# EasyEDA schematic pickup3.json
TITLE: Sheet_1; REV: 1.0; Date: 2023-07-27; Sheet: 1/1; Company: Your Company
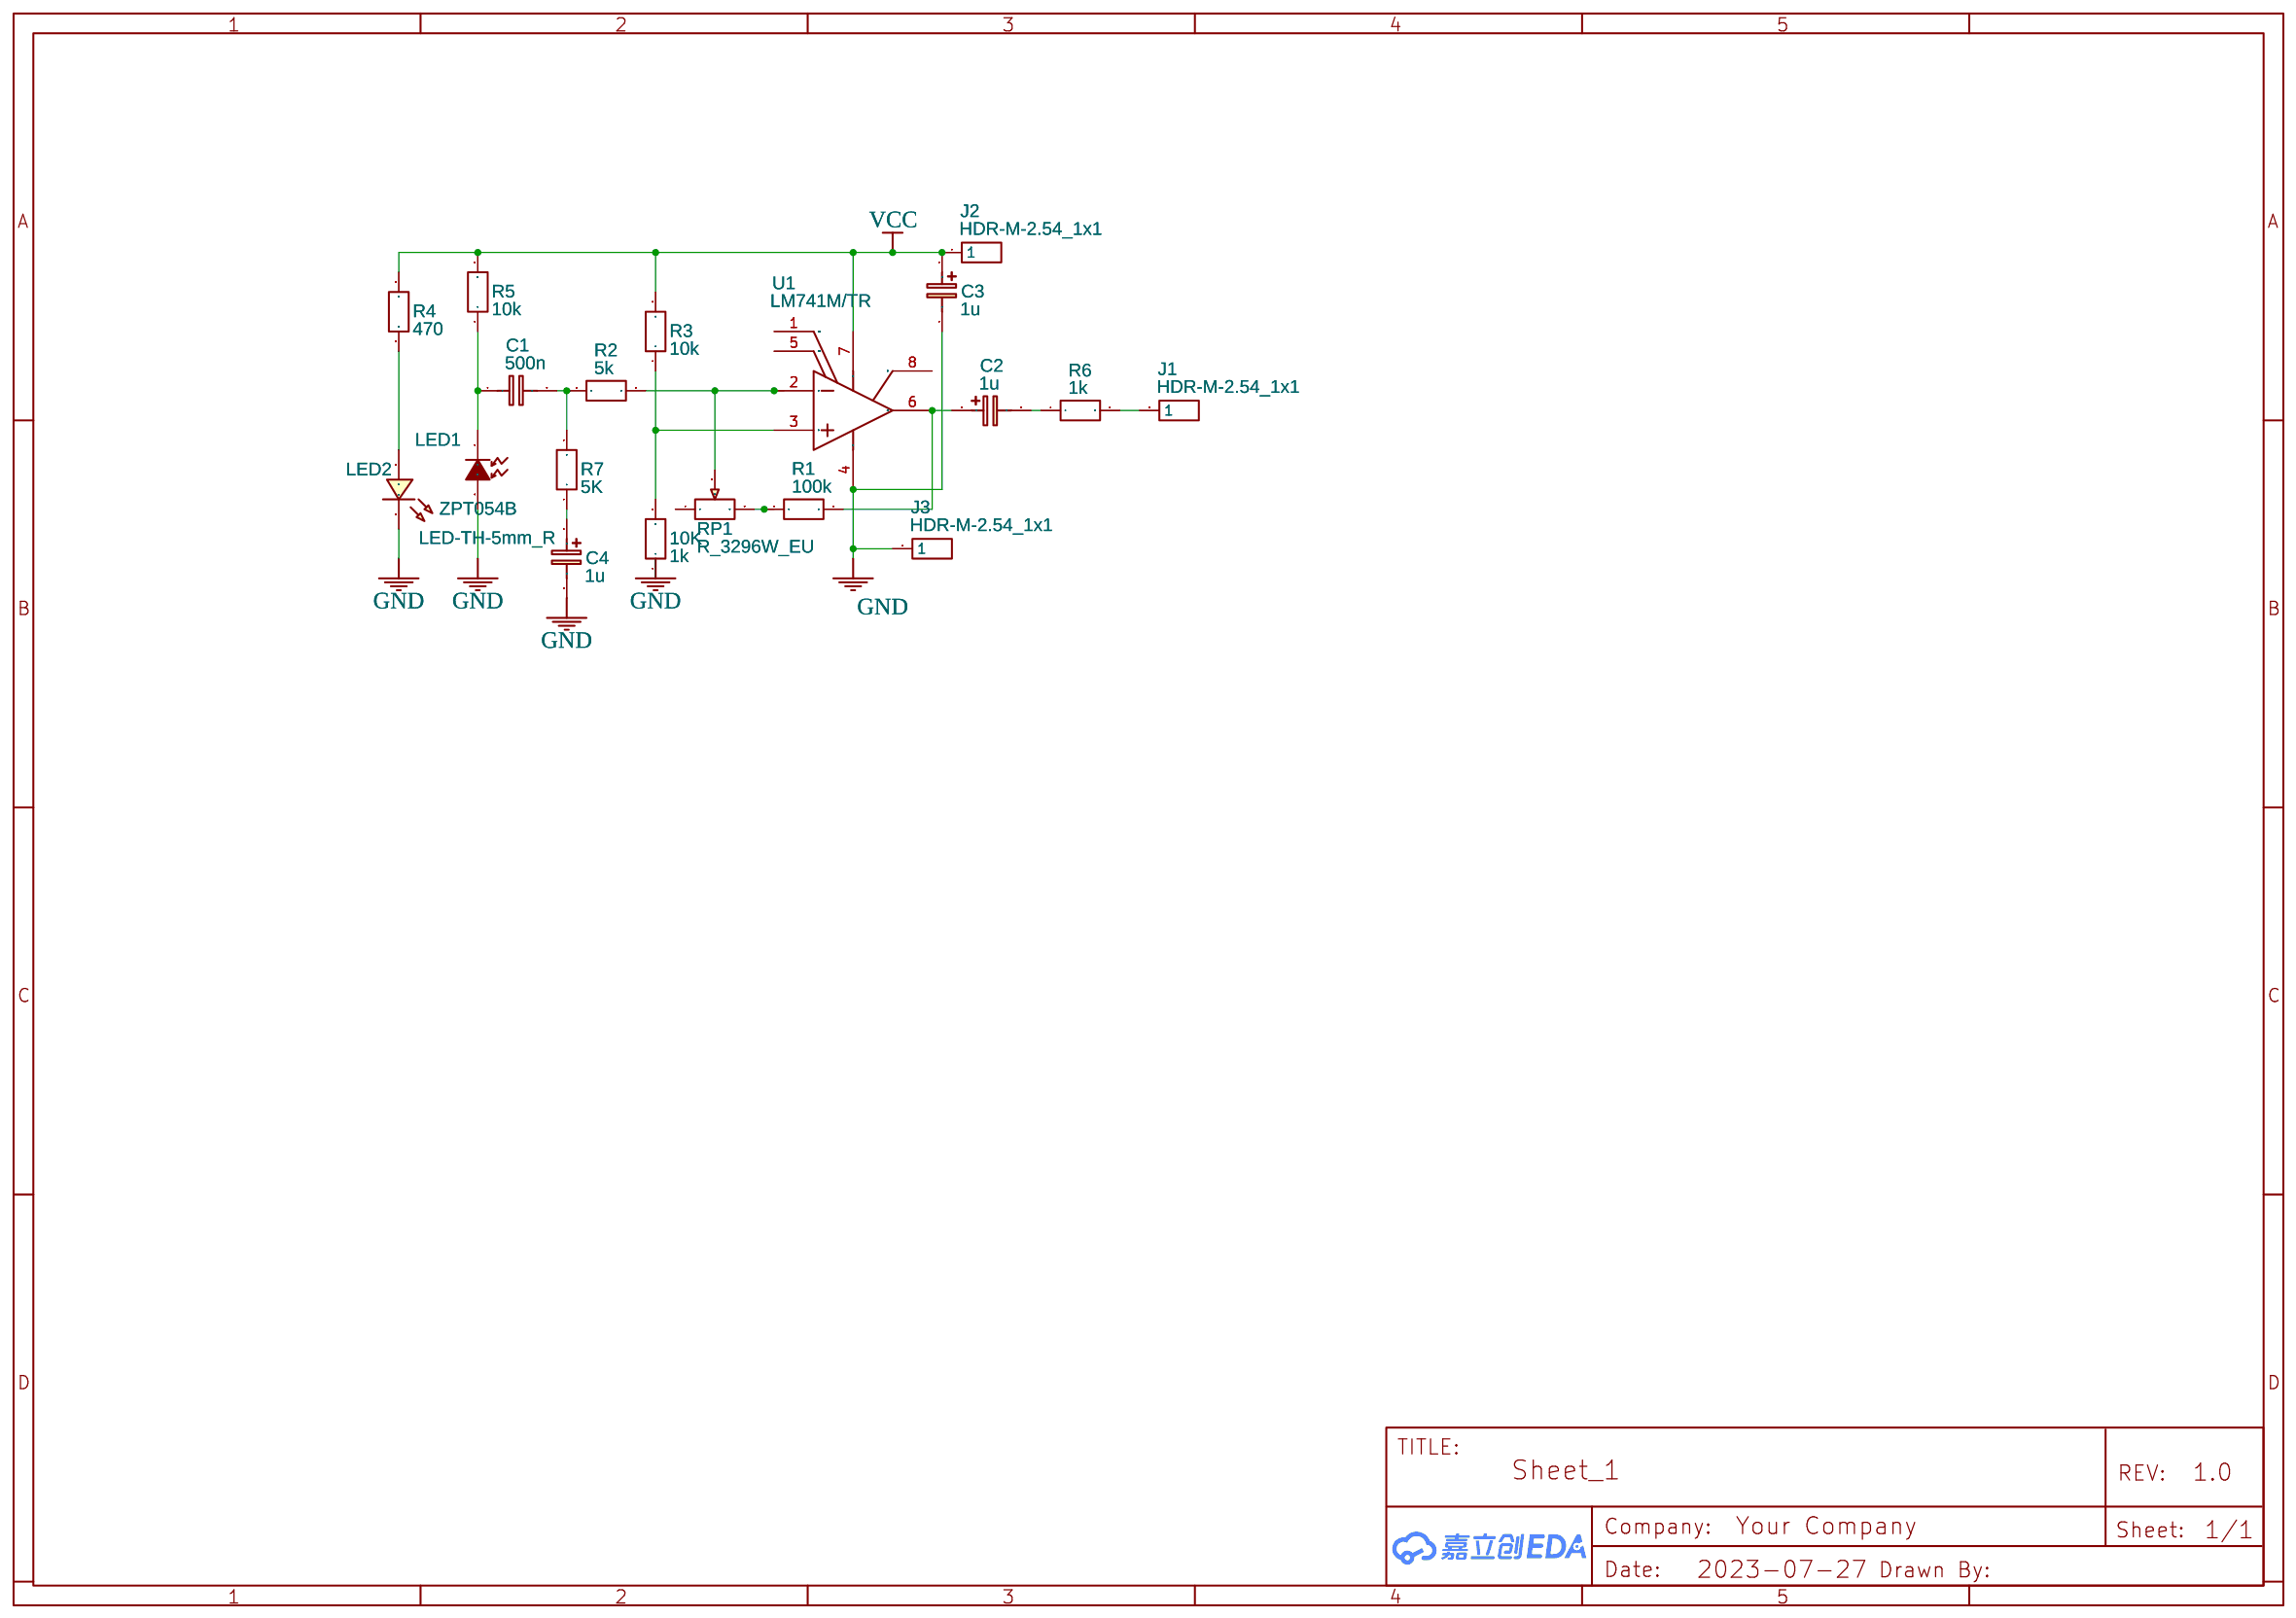
[diagram p0: schematic sheet]

## Parts
10K  1k  [R0603]
C1  500n  [C0603]
C2  1u  [CASE-A_3216]
C3  1u  [CASE-A_3216]
C4  1u  [CASE-A_3216]
J1  HDR-M-2.54_1x1  [HDR-M-2.54_1X1]
J2  HDR-M-2.54_1x1  [HDR-M-2.54_1X1]
J3  HDR-M-2.54_1x1  [HDR-M-2.54_1X1]
LED1  ZPT054B  [LED-TH_BD5.9-RD_DY-PT334-6B]
LED2  LED-TH-5mm_R  [LED-TH_BD5.0_RED]
R1  100k  [R0603]
R2  5k  [R0603]
R3  10k  [R0603]
R4  470  [R0603]
R5  10k  [R0603]
R6  1k  [R0603]
R7  5K  [R0603]
RP1  R_3296W_EU  [RES-ADJ-TH_3296W]
U1  LM741M/TR  [SOP-8_L4.9-W3.9-P1.27-LS6.0-BL]

## Library data of the parts
10K R1-R7 = R_0603_EU: Contributor: LCEDA_Lib
C1 = C_0603_EU: Contributor: LCEDA_Lib
C2-C4 = C_Tan_SMD_A_EU: Contributor: LCEDA_Lib
J1-J3 = HDR-M-2.54_1x1: Supplier Part: C81276; Supplier: LCSC; Contributor: LCEDA_Lib
LED1 = ZPT054B: Contributor: LCSC; Supplier: LCSC; Supplier Part: C575323; Manufacturer: Chau Light; JLCPCB Part Class: Extended Part
LED2 = LED-TH-5mm_R: Manufacturer: EVERLIGHT(台湾亿光); Manufacturer Part: 333-2SURD/S530-A3; Supplier Part: C87271; Supplier: LCSC; Contributor: LCEDA_Lib
RP1 = R_3296W_EU: Supplier: LCSC; Contributor: LCEDA_Lib; Value(Ω): 10k
U1 = LM741M/TR: Contributor: LCSC; Supplier: LCSC; Supplier Part: C356704; Manufacturer: HGSEMI(华冠); JLCPCB Part Class: Extended Part

## Nets
GND: 10K.1 C3.2 C4.2 J3.1 LED1.2(C) LED2.2 U1.4(V-)
VCC: C3.1 J2.1 R3.2 R4.2 R5.2 U1.7(V+)
Net-(10K-2): 10K.2 R3.1 U1.3(IN+)
Net-(C1-1): C1.1 LED1.1(E) R5.1
Net-(C1-2): C1.2 R2.1 R7.2
Net-(C2-1): C2.1 R1.2 U1.6(OUT)
Net-(C2-2): C2.2 R6.1
Net-(C4-1): C4.1 R7.1
Net-(J1-1): J1.1 R6.2
Net-(LED2-1): LED2.1 R4.1
Net-(R1-1): R1.1 RP1.3
Net-(R2-2): R2.2 RP1.2 U1.2(IN-)

Not connected (* = marked no-connect by the designer): RP1 1; U1 1(OFFSET_NULL) 5(OFFSET_NULL) 8(NC)
